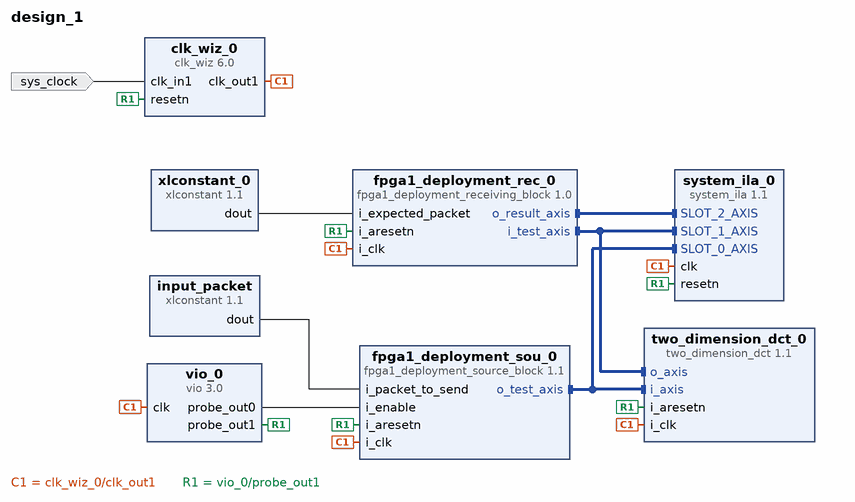
[diagram p0: block diagram of the top level]
# Vivado block design design_1, xc7a100tcsg324-1, Vivado 2018.3
create_bd_design design_1

create_bd_port -dir I -type clk sys_clock
set_property -dict {CONFIG.FREQ_HZ 100000000 CONFIG.PHASE 0.000} [get_bd_ports sys_clock]

create_bd_cell -type ip -vlnv user.org:user:fpga1_deployment_receiving_block:1.0 fpga1_deployment_rec_0
set_property -dict [list \
  CONFIG.AXIS_DATA_WIDTH 24 \
  CONFIG.NUM_BITS_PER_TRANSFER 17 \
  CONFIG.NUM_TRANSFERS 64 \
] [get_bd_cells fpga1_deployment_rec_0]
create_bd_cell -type ip -vlnv user.org:user:fpga1_deployment_source_block:1.1 fpga1_deployment_sou_0
set_property -dict [list \
  CONFIG.AXIS_DATA_WIDTH 24 \
  CONFIG.NUM_BITS_PER_TRANSFER 17 \
  CONFIG.NUM_TRANSFERS 64 \
] [get_bd_cells fpga1_deployment_sou_0]
create_bd_cell -type ip -vlnv xilinx.com:ip:clk_wiz:6.0 clk_wiz_0
set_property -dict [list \
  CONFIG.CLK_IN1_BOARD_INTERFACE sys_clock \
  CONFIG.RESET_PORT resetn \
  CONFIG.RESET_TYPE ACTIVE_LOW \
  CONFIG.USE_BOARD_FLOW true \
  CONFIG.USE_LOCKED false \
] [get_bd_cells clk_wiz_0]
create_bd_cell -type ip -vlnv xilinx.com:ip:system_ila:1.1 system_ila_0
set_property -dict [list \
  CONFIG.C_NUM_MONITOR_SLOTS 3 \
  CONFIG.C_SLOT 2 \
  CONFIG.C_SLOT_0_INTF_TYPE xilinx.com:interface:axis_rtl:1.0 \
  CONFIG.C_SLOT_1_INTF_TYPE xilinx.com:interface:axis_rtl:1.0 \
  CONFIG.C_SLOT_2_INTF_TYPE xilinx.com:interface:axis_rtl:1.0 \
] [get_bd_cells system_ila_0]
create_bd_cell -type ip -vlnv xilinx.com:ip:xlconstant:1.1 input_packet
set_property -dict [list \
  CONFIG.CONST_VAL 0b00010000000000000000011111100000000000111110000000000001111010000000000011110000000000000111011000000000001110100000000000011100100000000000111000000000000001101110000000000011011000000000000110101000000000001101000000000000011001100000000000110010000000000001100010000000000011000000000000000101111000000000001011100000000000010110100000000000101100000000000001010110000000000010101000000000000101001000000000001010000000000000010011100000000000100110000000000001001010000000000010010000000000000100011000000000001000100000000000010000100000000000100000000000000000111110000000000001111000000000000011101000000000000111000000000000001101100000000000011010000000000000110010000000000001100000000000000010111000000000000101100000000000001010100000000000010100000000000000100110000000000001001000000000000010001000000000000100000000000000000111100000000000001110000000000000011010000000000000110000000000000001011000000000000010100000000000000100100000000000001000000000000000001110000000000000011000000000000000101000000000000001000000000000000001100000000000000010000000000000000010000000 \
  CONFIG.CONST_WIDTH 1088 \
] [get_bd_cells input_packet]
create_bd_cell -type ip -vlnv xilinx.com:ip:vio:3.0 vio_0
set_property -dict {CONFIG.C_NUM_PROBE_IN 0 CONFIG.C_NUM_PROBE_OUT 2} [get_bd_cells vio_0]
create_bd_cell -type ip -vlnv xilinx.com:ip:xlconstant:1.1 xlconstant_0
set_property -dict {CONFIG.CONST_VAL 0b1 CONFIG.CONST_WIDTH 1088} [get_bd_cells xlconstant_0]
create_bd_cell -type ip -vlnv user.org:user:two_dimension_dct:1.1 two_dimension_dct_0

# ---- connections ----

connect_bd_intf_net [get_bd_intf_pins fpga1_deployment_rec_0/o_result_axis] [get_bd_intf_pins system_ila_0/SLOT_2_AXIS]
connect_bd_intf_net [get_bd_intf_pins fpga1_deployment_sou_0/o_test_axis] [get_bd_intf_pins two_dimension_dct_0/i_axis]
connect_bd_intf_net [get_bd_intf_pins fpga1_deployment_sou_0/o_test_axis] [get_bd_intf_pins system_ila_0/SLOT_0_AXIS]
connect_bd_intf_net -intf_net frame_destructor_cus_0_o_axis [get_bd_intf_pins fpga1_deployment_rec_0/i_test_axis] [get_bd_intf_pins two_dimension_dct_0/o_axis]
connect_bd_intf_net [get_bd_intf_pins fpga1_deployment_rec_0/i_test_axis] [get_bd_intf_pins system_ila_0/SLOT_1_AXIS]
connect_bd_net [get_bd_pins input_packet/dout] [get_bd_pins fpga1_deployment_sou_0/i_packet_to_send]
connect_bd_net [get_bd_pins clk_wiz_0/clk_out1] \
  [get_bd_pins vio_0/clk] [get_bd_pins fpga1_deployment_sou_0/i_clk] [get_bd_pins fpga1_deployment_rec_0/i_clk] \
  [get_bd_pins system_ila_0/clk] [get_bd_pins two_dimension_dct_0/i_clk]
connect_bd_net [get_bd_pins vio_0/probe_out1] \
  [get_bd_pins system_ila_0/resetn] [get_bd_pins fpga1_deployment_rec_0/i_aresetn] \
  [get_bd_pins fpga1_deployment_sou_0/i_aresetn] [get_bd_pins clk_wiz_0/resetn] [get_bd_pins two_dimension_dct_0/i_aresetn]
connect_bd_net [get_bd_pins vio_0/probe_out0] [get_bd_pins fpga1_deployment_sou_0/i_enable]
connect_bd_net [get_bd_ports sys_clock] [get_bd_pins clk_wiz_0/clk_in1]
connect_bd_net [get_bd_pins xlconstant_0/dout] [get_bd_pins fpga1_deployment_rec_0/i_expected_packet]

validate_bd_design
save_bd_design
